# EAGLE design DXProMiniBoard (EAGLE 8.2.2)
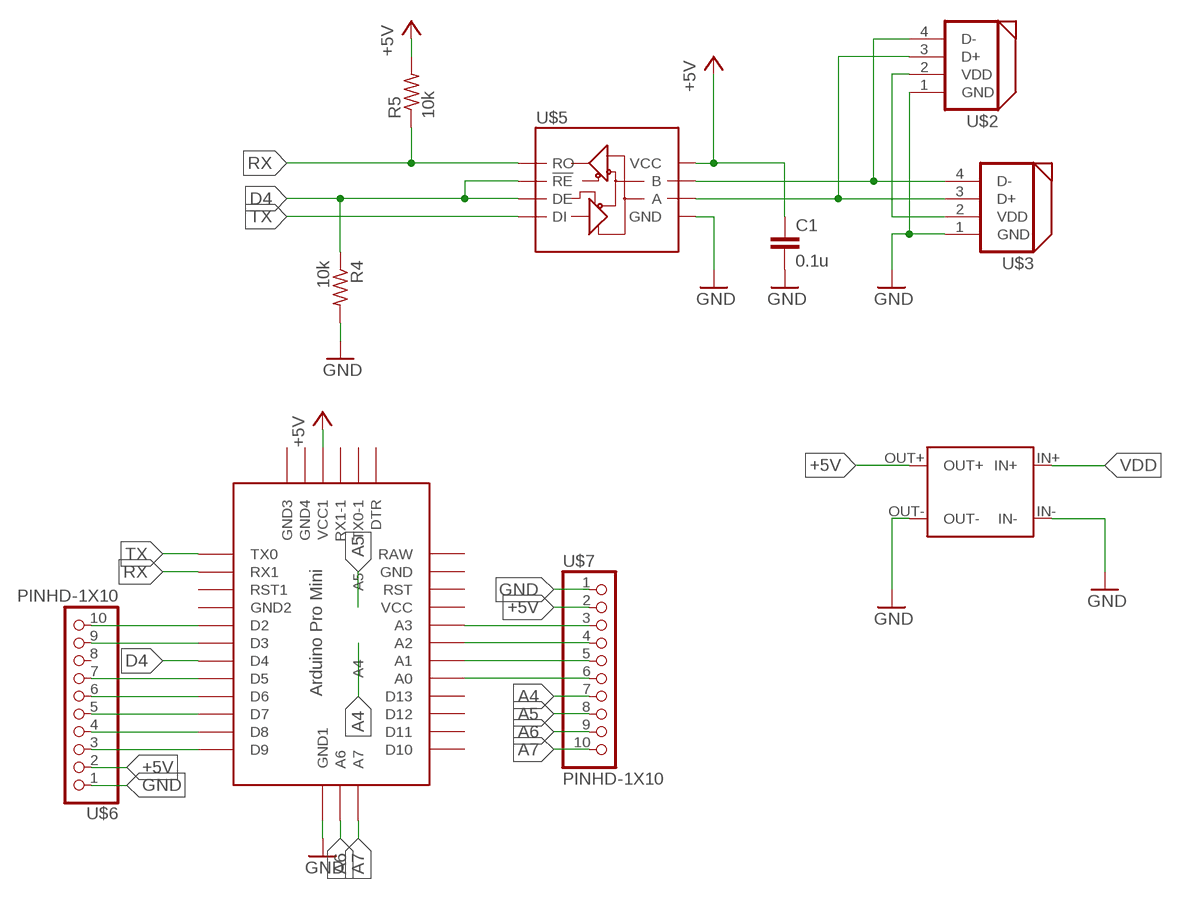
[diagram p0: schematic, sheet 1]

## Parts
C1  0.1u  C2.5/2  [C2.5-2]
R4  10k  R-US_0207/10  [0207/10]
R5  10k  R-US_0207/10  [0207/10]
U$1  MH-MINI-360MH  [MH-MINI-360]
U$2  DYNAMIXEL_RS485  [DYNAMIXEL_SPOX_04]
U$3  DYNAMIXEL_RS485  [DYNAMIXEL_SPOX_04]
U$4  ABK-PRO-MINI  [ABK-PRO-MINI]
U$5  SN75176B  [DIL08]
U$6  PINHD-1X10  [1X10-BIG]
U$7  PINHD-1X10  [1X10-BIG]

## Nets
+5V: C1.1 R5.2 U$1.OUT+ U$4.VCC1 U$5.8(VCC) U$6.2 U$7.2
A4: U$4.A4 U$7.7
A5: U$4.A5 U$7.8
A6: U$4.A6 U$7.9
A7: U$4.A7 U$7.10
D4: R4.1 U$4.D4 U$5.2(!RE) U$5.3(DE)
GND: C1.2 R4.2 U$1.IN- U$1.OUT- U$2.1(GND) U$3.1(GND) U$4.GND4(GND1) U$5.5(GND) U$6.1 U$7.1
N$1: U$2.4(D-) U$3.4(D-) U$5.7(B)
N$2: U$2.3(D+) U$3.3(D+) U$5.6(A)
N$3: U$4.D2 U$6.10
N$4: U$4.D3 U$6.9
N$5: U$4.D5 U$6.7
N$6: U$4.D6 U$6.6
N$7: U$4.D7 U$6.5
N$8: U$4.D8 U$6.4
N$9: U$4.D9 U$6.3
N$10: U$4.A3 U$7.3
N$11: U$4.A2 U$7.4
N$12: U$4.A1 U$7.5
N$13: U$4.A0 U$7.6
RX: R5.1 U$4.RX1 U$5.1(RO)
TX: U$4.TX0 U$5.4(DI)
VDD: U$1.IN+ U$2.2(VDD) U$3.2(VDD)
Unconnected: U$4.D10 U$4.D11 U$4.D12 U$4.D13 U$4.DTR U$4.GND U$4.GND1(GND2) U$4.GND2(GND3) U$4.GND3(GND4) U$4.RAW U$4.RST U$4.RST1 U$4.RX1-1 U$4.TX0-1 U$4.VCC U$6.8

## Library data of the parts
C1 = capacitor-wima:C: CAPACITOR naming: grid - package width
R4 R5 = resistor:R-US_: RESISTOR, American symbol
U$1 = uchile_robotics_eagle_lib:MH-MINI-360
U$2 U$3 = uchile_robotics_eagle_lib:DYNAMIXEL_RS485: Dynamixel RS-485 Connector Molex LLC SPOX 4 Male connector Digikey code: WM18888-ND
U$4 = Arduino-clone:ABK-PRO-MINI: ABK Pro-Mini Arduino Clone
U$5 = uchile_robotics_eagle_lib:SN75176B: SN75176B Datasheet: http://www.ti.com/lit/ds/symlink/sn75176b.pdf
U$6 U$7 = adafruit:PINHD-1X10: Pin header 1x10 0.1" spacing With round pins

## Board
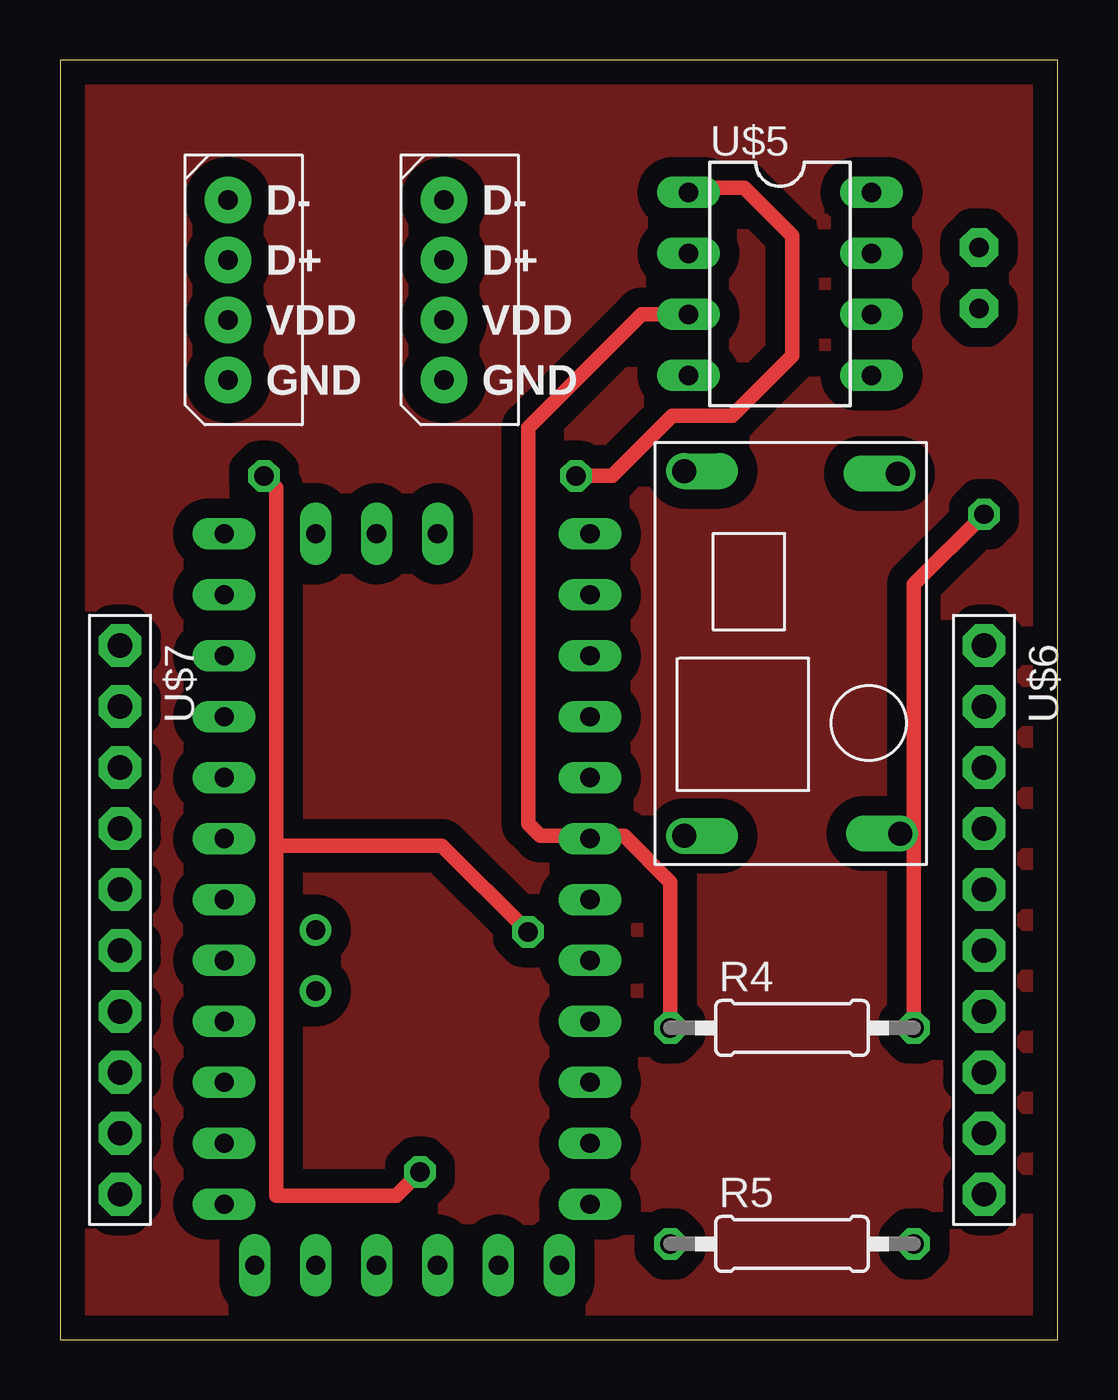
[diagram p1: board, top side]
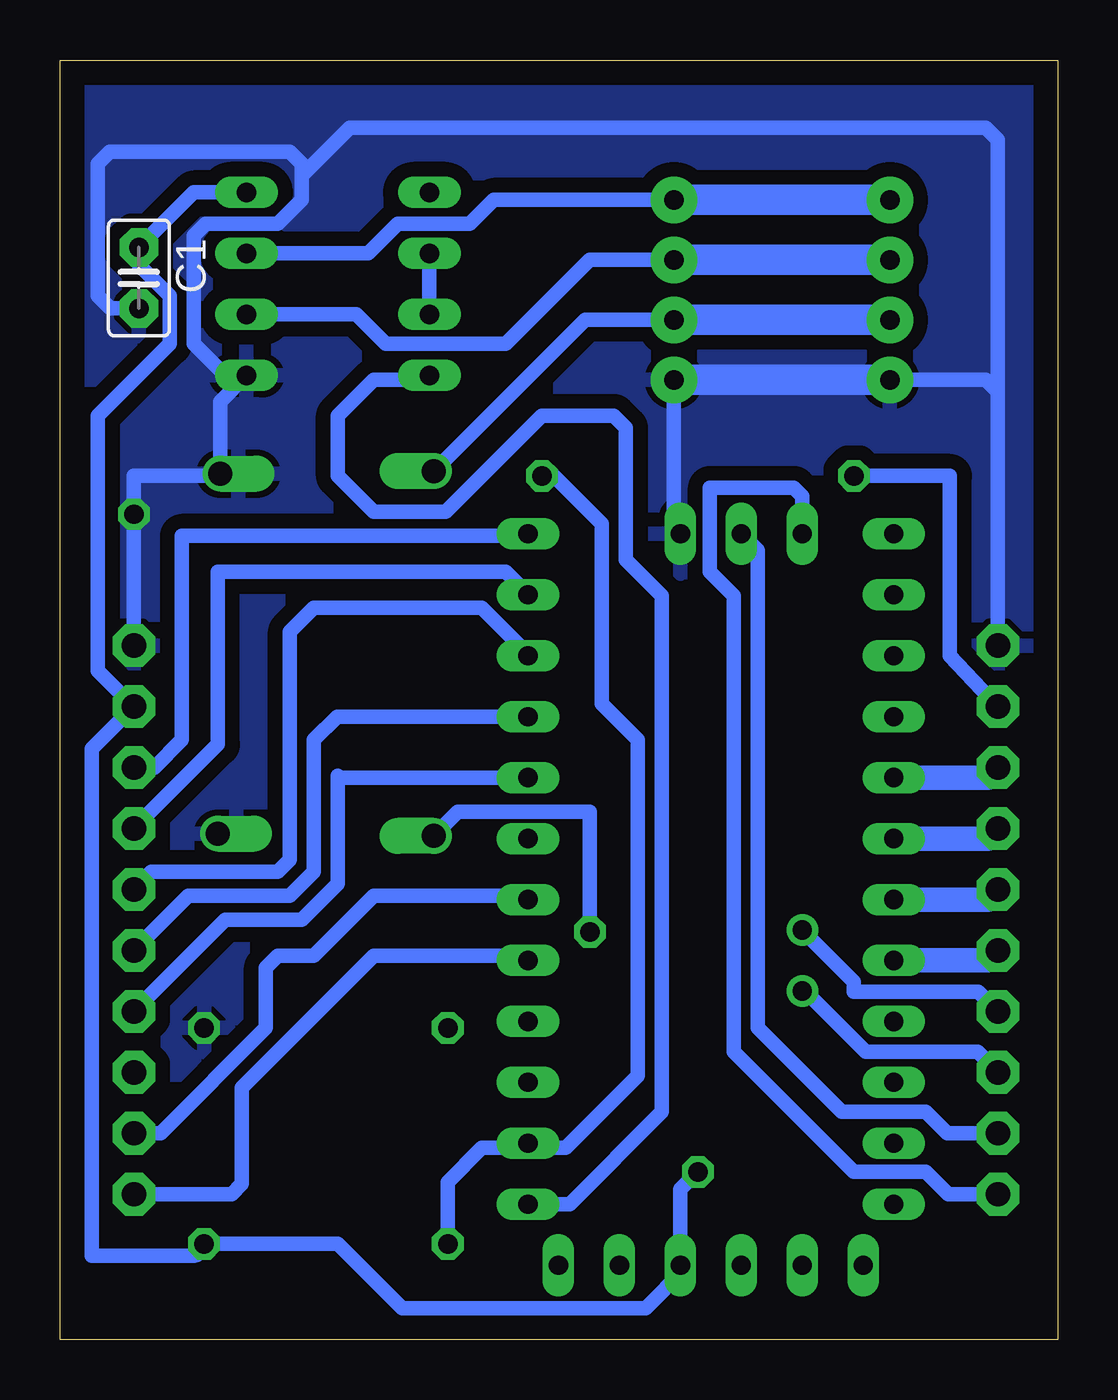
[diagram p2: board, bottom side, seen from below]

Size 41.58 x 53.33 mm. Coordinates in mm from the lower left corner, seen from the top.
Outline: 0,0 41.58,0 41.58,53.33 0,53.33 0,0
Copper layers (1*16): Top 0.035mm / dielectric 1.5mm / Bottom 0.035mm
Design rules "default": minimum track width 6mil, minimum drill 0.35mm, track to track 6mil, track to pad 6mil, pad to pad 6mil, via to via 6mil, smd to smd 6mil, copper to edge 40mil, drill to drill 6mil, minimum pad ring 10mil, minimum via ring 8mil, stop-mask expansion 4mil, vias tented up to drill 0mil, thermal gap 10mil

### Footprints (pad centres in the part's own frame; a part is rotated, then mirrored left to right if it is on the bottom)
C2.5-2 = drill 0.813 pad 1.6 octagon: 1 -1.27,0; 2 1.27,0
0207/10 = drill 0.813 octagon: 1 -5.08,0; 2 5.08,0
MH-MINI-360 = drill 1 offset: IN+ 0,15.2; IN- 8.9,15.1; OUT+ 0,0; OUT- 9,0.1
DYNAMIXEL_SPOX_04 = drill 0.8 pad 1.93: 1 0,0; 2 2.5,0; 3 5,0; 4 7.5,0
ABK-PRO-MINI = drill 0.8 long: A0 10.16,-3.81; A1 10.16,-6.35; A2 10.16,-8.89; A3 10.16,-11.43; A6 3.81,-21.59; A7 6.35,-21.59; D2 -5.08,-3.81; D3 -5.08,-6.35; D4 -5.08,-8.89; D5 -5.08,-11.43; D6 -5.08,-13.97; D7 -5.08,-16.51; D8 -5.08,-19.05; D9 -5.08,-21.59; D10 10.16,-21.59; D11 10.16,-19.05; D12 10.16,-16.51; D13 10.16,-13.97; DTR 8.89,8.89; GND 10.16,3.81; GND1 -5.08,-1.27; GND2 -3.81,8.89; GND3 -1.27,8.89; GND4 1.27,-21.59; RAW 10.16,6.35; RST 10.16,1.27; RST1 -5.08,1.27; RX1 -5.08,3.81; RX1-1 3.81,8.89; TX0 -5.08,6.35; TX0-1 6.35,8.89; VCC 10.16,-1.27; VCC1 1.27,8.89 | drill 0.8: A4 6.35,-5.08; A5 6.35,-2.54
DIL08 = drill 0.813 long: 1 -3.81,-3.81; 2 -1.27,-3.81; 3 1.27,-3.81; 4 3.81,-3.81; 5 3.81,3.81; 6 1.27,3.81; 7 -1.27,3.81; 8 -3.81,3.81
1X10-BIG = drill 1.016 pad 1.778 octagon: 1 -11.43,0; 2 -8.89,0; 3 -6.35,0; 4 -3.81,0; 5 -1.27,0; 6 1.27,0; 7 3.81,0; 8 6.35,0; 9 8.89,0; 10 11.43,0

### Placement (x,y rotation side)
C1  38.29,44.25 270 bottom
R4  30.5,13 0 top
R5  30.5,4 0 top
U$1  26,21 0 top
U$2  7,40 90 top
U$3  16,40 90 top
U$4  17,12 180 top
U$5  30,44 270 top
U$6  38.5,17.5 270 top
U$7  2.5,17.5 270 top

### Tracks (layer width: path | path; a pad name or v marks a point on that pad's centre or on a via)
+5V  (via drill 0.8 pad 1.3)
  Top 0.61: v8.5,36 9,35.5 9,20.59 | 9,20.59 9,6 14,6 v15,7 | v19.5,17 15.91,20.59 9,20.59
  Bottom 0.61: U$5.8 36,47.81 C1.1 38.29,44.79 37,43.5 37,41.5 40,38.5 40,27.89 U$6.2 40.26,24.63 40.26,3.5 36.08,3.5 arc-90 R5.2 30,4 27.32,1.32 17.18,1.32 | U$7.2 4.5,28.5 4.5,36 v8.5,36 | v15,7 15.73,6.27 U$4.VCC1 15.73,2.77 17.01,1.49 | 17.01,1.49 17.18,1.32 | U$1.OUT+ 25,22 20.97,22 20.96,22 19.5,22 v19.5,17 | 17.18,1.32 17.01,1.49
A4
  Bottom 0.61: U$7.7 3.31,14.5 8.5,14.5 8.5,14.93 U$4.A4
A5
  Bottom 0.61: U$4.A5 10.54,14.54 8,12 3.35,12 U$7.8
A6
  Bottom 0.61: U$7.9 4.61,8.61 5.5,9.5 9,9.5 12.5,13 12.5,32.9 U$4.A6
A7
  Bottom 0.61: U$7.10 4.57,6.07 5.5,7 8.5,7 13.5,12 13.5,31 14.5,32 14.5,35.5 11,35.5 10.65,35.15 U$4.A7
D4
  Top 0.61: R4.1 25.42,19.08 23.5,21 22.19,21 U$4.D4 21.97,21 20,21 19.5,21.5 19.5,38 24.23,42.73 U$5.3
  Bottom 0.61: U$5.2 U$5.3
GND  (via drill 0.8 pad 1.3)
  Top 0.61: v38.5,34.4 35.58,31.48 35.58,21.11 | 35.58,21.11 R4.2 | U$1.OUT- 35.58,21.11
  Bottom 0.61: 2.5,39.5 U$7.1 | 2.5,39.5 3,40 U$2.1 | 31.5,48.5 31.5,47.5 32.5,46.5 35.5,46.5 36,46 36,41.5 34.69,40.19 U$5.5 34.9,39.1 U$1.IN- 35,36 38.5,36 v38.5,34.4 U$6.1 | 31.5,48.5 31.5,49 32,49.5 39.5,49.5 40,49 40,43.5 39.48,42.98 C1.2 | 31.5,48.5 29.5,50.5 3,50.5 2.5,50 2.5,39.5 | U$4.GND4 16,33.86 U$3.1
  Bottom 1.27: U$3.1 U$2.1
  pour Bottom (isolate 0.61): 0,0 41.5,0 41.5,53.5 0,53.5
N$1
  Bottom 0.61: U$3.4 23.5,47.5 24.5,46.5 27.5,46.5 28.73,45.27 U$5.7
  Bottom 1.27: U$2.4 U$3.4
N$2
  Bottom 0.61: U$5.6 29.23,42.73 28,41.5 23,41.5 19.5,45 U$3.3
  Bottom 1.27: U$3.3 U$2.3
N$3
  Bottom 0.61: U$6.10 34.43,6.07 34,6.5 34,10.5 28.5,16 22.27,16 U$4.D2
N$4
  Bottom 0.61: U$6.9 37.39,8.61 33,13 33,15.5 32.5,16 31,16 28.5,18.5 22.23,18.5 U$4.D3
N$5
  Bottom 0.61: U$6.7 34.69,17.5 31.5,17.5 30,19 30,23.5 29.93,23.43 U$4.D5
N$6
  Bottom 0.61: U$6.6 36.23,18.5 32,18.5 31,19.5 31,25 30.03,25.97 U$4.D6
N$7
  Bottom 0.61: U$6.5 37.77,19.5 32.5,19.5 32,20 32,29.5 31,30.5 24,30.5 22.08,28.58 U$4.D7
N$8
  Bottom 0.61: U$6.4 35,24.81 35,32 23,32 22.08,31.08 U$4.D8
N$9
  Bottom 0.61: U$4.D9 22.17,33.5 36.5,33.5 36.5,25 37.65,23.85 U$6.3
N$10
  Bottom 1.016: U$7.3 2.92,23.43 U$4.A3
N$11
  Bottom 1.016: U$7.4 2.92,20.89 U$4.A2
N$12
  Bottom 1.016: U$7.5 2.92,18.35 U$4.A1
N$13
  Bottom 1.016: U$7.6 2.92,15.81 U$4.A0
N$14
  pour Top (isolate 0.813): 0,0 41.5,0 41.5,53.5 0,53.5
RX  (via drill 0.8 pad 1.3)
  Top 0.61: v21.5,36 23,36 25.5,38.5 28,38.5 30.5,41 30.5,46 28.5,48 26.38,48 U$5.1
  Bottom 0.61: R5.1 25.42,6.58 24,8 22.27,8 | 22.27,8 U$4.RX1 21.31,8.19 | v21.5,36 21,36 19,34 19,26.5 17.5,25 17.5,11 20.5,8 22.27,8
TX
  Bottom 0.61: U$4.TX0 20.35,5.65 16.5,9.5 16.5,31 18,32.5 18,38 18.5,38.5 21.5,38.5 25.5,34.5 28.5,34.5 30,36 30,38.5 28.5,40 26.38,40 U$5.4
VDD
  Bottom 0.61: U$3.2 19.7,42.5 U$1.IN+
  Bottom 1.27: U$2.2 U$3.2